# EAGLE design Sonar (EAGLE 7.3.0)
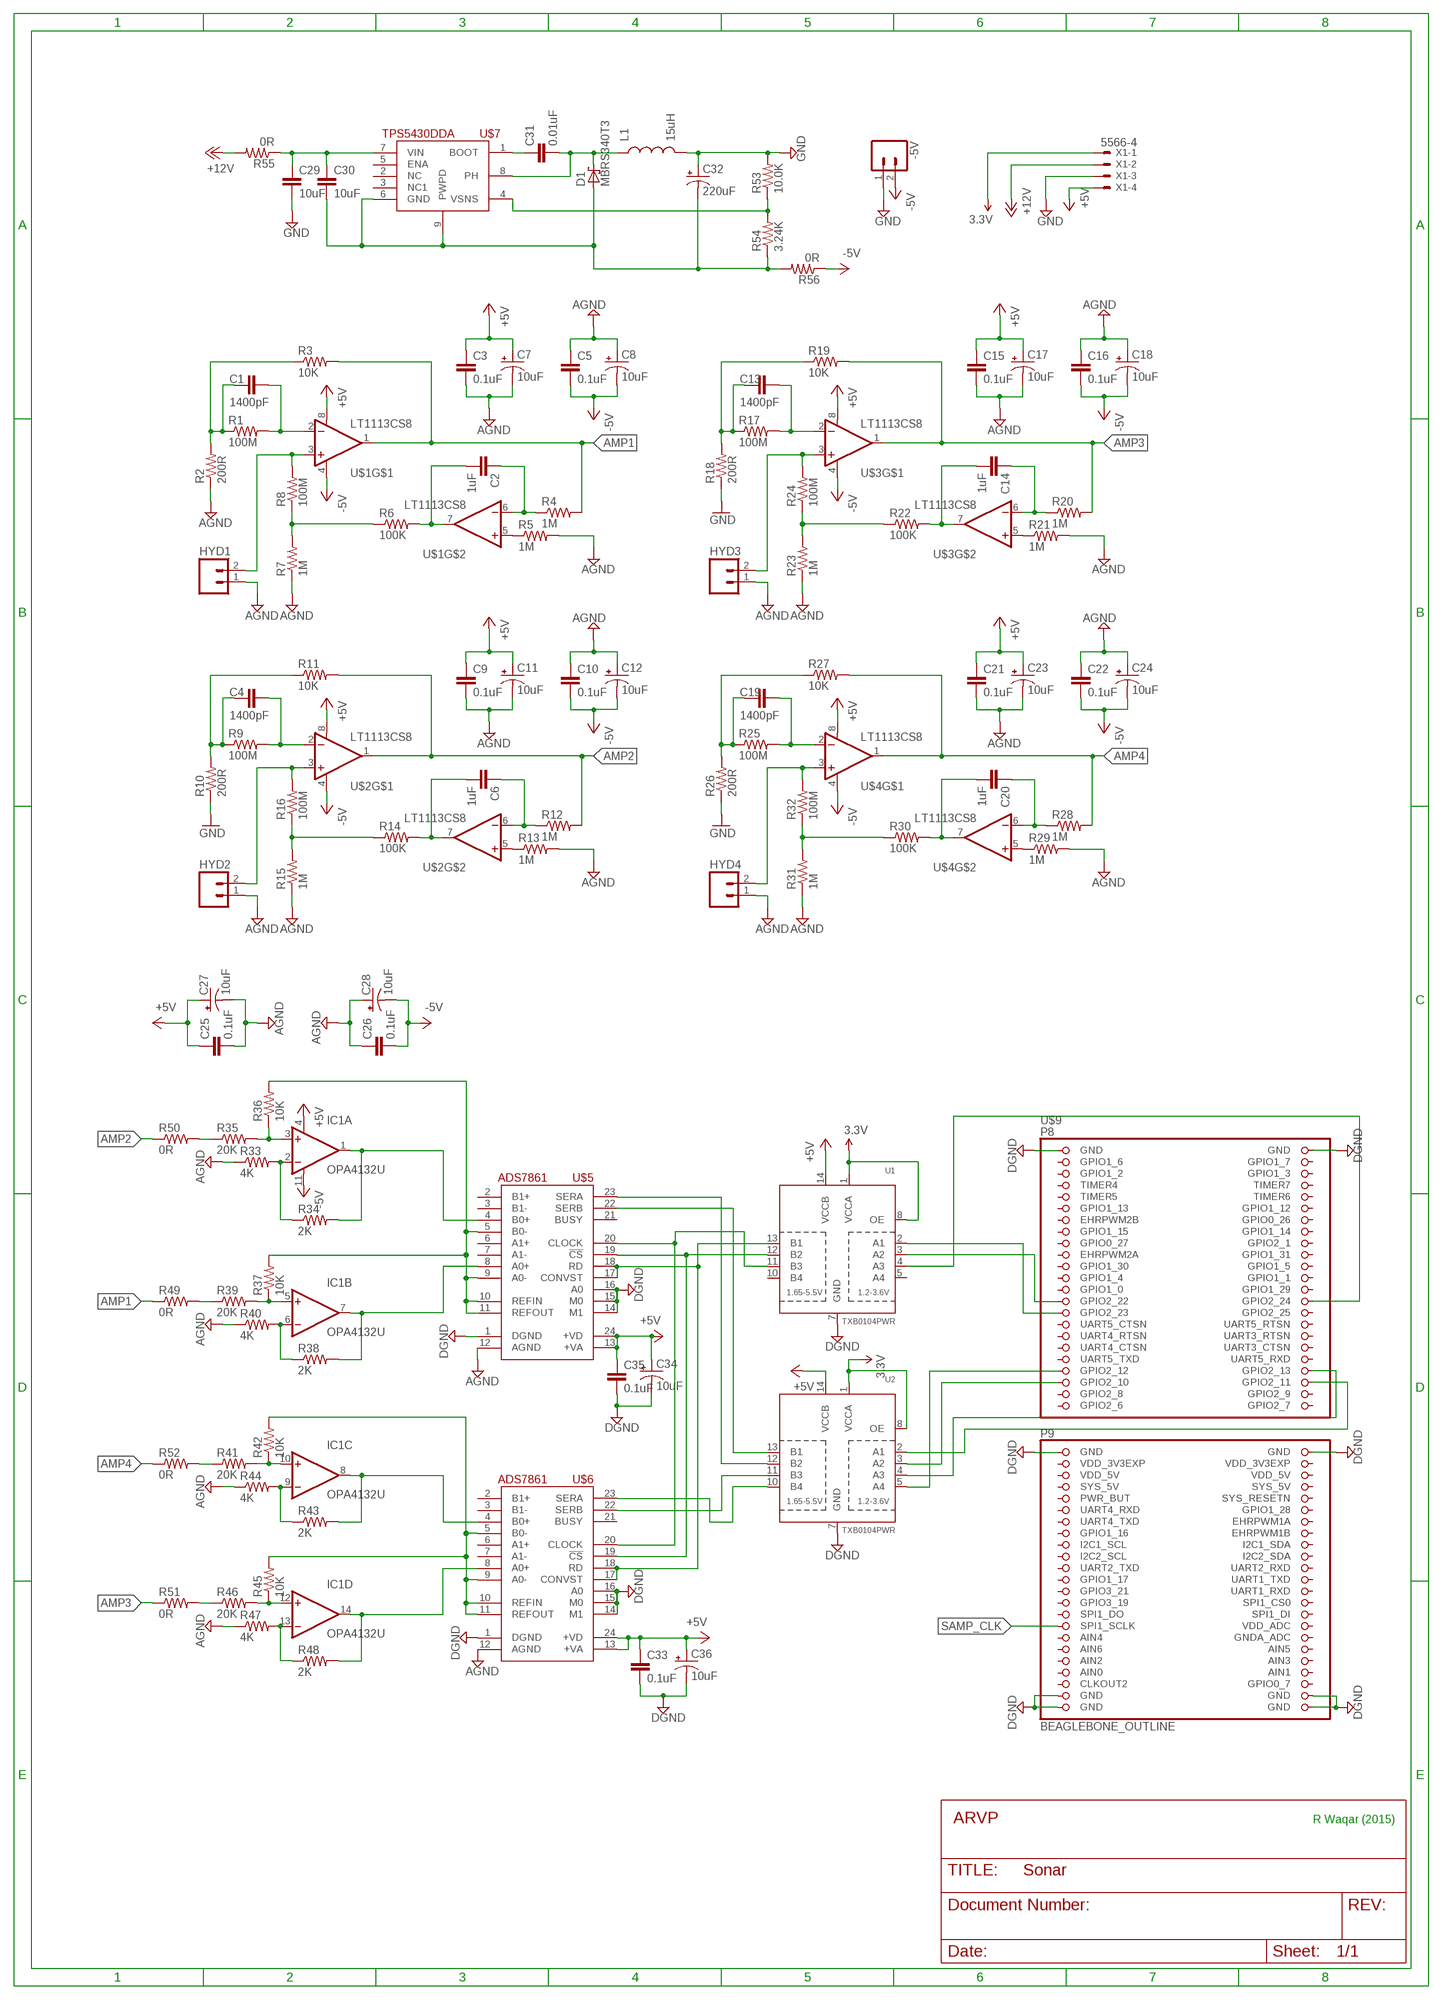
[diagram p0: schematic, sheet 1]

## Parts
-5V  M02PTH3  [1X02_LONGPADS]
C1  1400pF  CAP0805  [0805]
C2  1uF  CAP0805  [0805]
C3  0.1uF  CAP0805  [0805]
C4  1400pF  CAP0805  [0805]
C5  0.1uF  CAP0805  [0805]
C6  1uF  CAP0805  [0805]
C7  10uF  CAP_POL1206  [EIA3216]
C8  10uF  CAP_POL1206  [EIA3216]
C9  0.1uF  CAP0805  [0805]
C10  0.1uF  CAP0805  [0805]
C11  10uF  CAP_POL1206  [EIA3216]
C12  10uF  CAP_POL1206  [EIA3216]
C13  1400pF  CAP0805  [0805]
C14  1uF  CAP0805  [0805]
C15  0.1uF  CAP0805  [0805]
C16  0.1uF  CAP0805  [0805]
C17  10uF  CAP_POL1206  [EIA3216]
C18  10uF  CAP_POL1206  [EIA3216]
C19  1400pF  CAP0805  [0805]
C20  1uF  CAP0805  [0805]
C21  0.1uF  CAP0805  [0805]
C22  0.1uF  CAP0805  [0805]
C23  10uF  CAP_POL1206  [EIA3216]
C24  10uF  CAP_POL1206  [EIA3216]
C25  0.1uF  CAP0805  [0805]
C26  0.1uF  CAP0805  [0805]
C27  10uF  CAP_POL1206  [EIA3216]
C28  10uF  CAP_POL1206  [EIA3216]
C29  10uF  CAP0805  [0805]
C30  10uF  CAP0805  [0805]
C31  0.01uF  CAP0805  [0805]
C32  220uF  CAP_POL7343  [EIA7343]
C33  0.1uF  CAP0805  [0805]
C34  10uF  CAP_POL1206  [EIA3216]
C35  0.1uF  CAP0805  [0805]
C36  10uF  CAP_POL1206  [EIA3216]
D1  MBRS340T3  [SMC]
HYD1  M02POLAR  [MOLEX-1X2]
HYD2  M02POLAR  [MOLEX-1X2]
HYD3  M02POLAR  [MOLEX-1X2]
HYD4  M02POLAR  [MOLEX-1X2]
IC1  OPA4132U  [SO14]
L1  15uH  INDUCTOR1210  [1210]
R1  100M  RESISTOR0805-RES  [0805]
R2  200R  RESISTORAXIAL-0.3  [AXIAL-0.3]
R3  10K  RESISTORAXIAL-0.3  [AXIAL-0.3]
R4  1M  RESISTOR0805-RES  [0805]
R5  1M  RESISTOR0805-RES  [0805]
R6  100K  RESISTOR0805-RES  [0805]
R7  1M  RESISTOR0805-RES  [0805]
R8  100M  RESISTOR0805-RES  [0805]
R9  100M  RESISTOR0805-RES  [0805]
R10  200R  RESISTORAXIAL-0.3  [AXIAL-0.3]
R11  10K  RESISTORAXIAL-0.3  [AXIAL-0.3]
R12  1M  RESISTOR0805-RES  [0805]
R13  1M  RESISTOR0805-RES  [0805]
R14  100K  RESISTOR0805-RES  [0805]
R15  1M  RESISTOR0805-RES  [0805]
R16  100M  RESISTOR0805-RES  [0805]
R17  100M  RESISTOR0805-RES  [0805]
R18  200R  RESISTORAXIAL-0.3  [AXIAL-0.3]
R19  10K  RESISTORAXIAL-0.3  [AXIAL-0.3]
R20  1M  RESISTOR0805-RES  [0805]
R21  1M  RESISTOR0805-RES  [0805]
R22  100K  RESISTOR0805-RES  [0805]
R23  1M  RESISTOR0805-RES  [0805]
R24  100M  RESISTOR0805-RES  [0805]
R25  100M  RESISTOR0805-RES  [0805]
R26  200R  RESISTORAXIAL-0.3  [AXIAL-0.3]
R27  10K  RESISTORAXIAL-0.3  [AXIAL-0.3]
R28  1M  RESISTOR0805-RES  [0805]
R29  1M  RESISTOR0805-RES  [0805]
R30  100K  RESISTOR0805-RES  [0805]
R31  1M  RESISTOR0805-RES  [0805]
R32  100M  RESISTOR0805-RES  [0805]
R33  4K  RESISTOR0805-RES  [0805]
R34  2K  RESISTOR0805-RES  [0805]
R35  20K  RESISTOR0805-RES  [0805]
R36  10K  RESISTOR0805-RES  [0805]
R37  10K  RESISTOR0805-RES  [0805]
R38  2K  RESISTOR0805-RES  [0805]
R39  20K  RESISTOR0805-RES  [0805]
R40  4K  RESISTOR0805-RES  [0805]
R41  20K  RESISTOR0805-RES  [0805]
R42  10K  RESISTOR0805-RES  [0805]
R43  2K  RESISTOR0805-RES  [0805]
R44  4K  RESISTOR0805-RES  [0805]
R45  10K  RESISTOR0805-RES  [0805]
R46  20K  RESISTOR0805-RES  [0805]
R47  4K  RESISTOR0805-RES  [0805]
R48  2K  RESISTOR0805-RES  [0805]
R49  0R  RESISTOR1206  [1206]
R50  0R  RESISTOR1206  [1206]
R51  0R  RESISTOR1206  [1206]
R52  0R  RESISTOR1206  [1206]
R53  10.0K  RESISTOR0805-RES  [0805]
R54  3.24K  RESISTOR0805-RES  [0805]
R55  0R  RESISTOR1206  [1206]
R56  0R  RESISTOR1206  [1206]
U1  TXB0104PWR  [TSSOP14]
U2  TXB0104PWR  [TSSOP14]
U$1  LT1113CS8  [SO-08]
U$2  LT1113CS8  [SO-08]
U$3  LT1113CS8  [SO-08]
U$4  LT1113CS8  [SO-08]
U$5  ADS7861E  [SSOP24]
U$6  ADS7861E  [SSOP24]
U$7  TPS5430DDA  [SOIC8-POWERPAD]
U$8  ARVP_LOGO  [ARVP]
U$9  BEAGLEBONE_OUTLINE  [BEAGLEBONE_SHIELD]
X1  5566-4  [5566-4]

## Nets
3.3V: U1.1(VCCA) U1.8(OE) U2.1(VCCA) U2.8(OE) X1.1
+5V: C3.1 C7.A(+) C9.1 C11.A(+) C15.1 C17.A(+) C21.1 C23.A(+) C25.1 C27.A(+) C33.1 C34.A(+) C35.1 C36.A(+) IC1.4(A:V+) U1.14(VCCB) U2.14(VCCB) U$1.8(V+) U$2.8(V+) U$3.8(V+) U$4.8(V+) U$5.13(+VA) U$5.24(+VD) U$6.13(+VA) U$6.24(+VD) X1.4
+12V: R55.2 X1.2
-5V: -5V.2 C5.2 C8.C(-) C10.2 C12.C(-) C16.2 C18.C(-) C22.2 C24.C(-) C26.2 C28.C(-) IC1.11(A:V-) R56.1 U$1.4(V-) U$2.4(V-) U$3.4(V-) U$4.4(V-)
AMP1: R3.P$2 R4.2 R49.1 U$1.1(OUT)
AMP2: R11.P$2 R12.2 R50.1 U$2.1(OUT)
AMP3: R19.P$2 R20.2 R51.1 U$3.1(OUT)
AMP4: R27.P$2 R28.2 R52.1 U$4.1(OUT)
GND: -5V.1 C3.2 C5.1 C7.C(-) C8.A(+) C9.2 C10.1 C11.C(-) C12.A(+) C15.2 C16.1 C17.C(-) C18.A(+) C21.2 C22.1 C23.C(-) C24.A(+) C25.2 C26.1 C27.C(-) C28.A(+) C29.2 C32.A(+) C33.2 C34.C(-) C35.2 C36.C(-) HYD1.1 HYD2.1 HYD3.1 HYD4.1 L1.2 R2.P$1 R5.2 R7.1 R10.P$1 R13.2 R15.1 R18.P$1 R21.2 R23.1 R26.P$1 R29.2 R31.1 R33.1 R40.1 R44.1 R47.1 R53.2 U1.7(GND) U2.7(GND) U$5.1(DGND) U$5.12(AGND) U$5.14(M1) U$5.15(M0) U$5.16(A0) U$6.1(DGND) U$6.12(AGND) U$6.14(M1) U$6.15(M0) U$6.16(A0) U$9.1(GND) U$9.2(GND) U$9.47(GND) U$9.48(GND) U$9.89(GND) U$9.90(GND) U$9.91(GND) U$9.92(GND) X1.3 ; supply symbol labelled DGND, AGND
N$1: C1.2 R1.1 R2.P$2 R3.P$1
N$2: C1.1 R1.2 U$1.2(-IN)
N$3: C4.2 R9.1 R10.P$2 R11.P$1
N$4: R6.1 R7.2 R8.1
N$5: HYD1.2 R8.2 U$1.3(+IN)
N$6: C4.1 R9.2 U$2.2(-IN)
N$7: C2.2 R6.2 U$1.7(OUT)
N$8: R5.1 U$1.5(+IN)
N$9: C2.1 R4.1 U$1.6(-IN)
N$10: R14.1 R15.2 R16.1
N$11: HYD2.2 R16.2 U$2.3(+IN)
N$12: C6.2 R14.2 U$2.7(OUT)
N$13: R13.1 U$2.5(+IN)
N$14: C6.1 R12.1 U$2.6(-IN)
N$15: C13.2 R17.1 R18.P$2 R19.P$1
N$16: C13.1 R17.2 U$3.2(-IN)
N$17: R22.1 R23.2 R24.1
N$18: HYD3.2 R24.2 U$3.3(+IN)
N$19: C14.2 R22.2 U$3.7(OUT)
N$20: R21.1 U$3.5(+IN)
N$21: C14.1 R20.1 U$3.6(-IN)
N$22: C19.2 R25.1 R26.P$2 R27.P$1
N$23: C19.1 R25.2 U$4.2(-IN)
N$24: R30.1 R31.2 R32.1
N$25: HYD4.2 R32.2 U$4.3(+IN)
N$26: C20.2 R30.2 U$4.7(OUT)
N$27: R29.1 U$4.5(+IN)
N$28: C20.1 R28.1 U$4.6(-IN)
N$29: IC1.3(A:+IN) R35.2 R36.1
N$30: IC1.1(A:OUT) R34.2 U$5.4(B0+)
N$31: IC1.2(A:-IN) R33.2 R34.1
N$32: R36.2 R37.2 U$5.5(B0-) U$5.9(A0-) U$5.10(REFIN) U$5.11(REFOUT)
N$33: IC1.5(B:+IN) R37.1 R39.2
N$34: IC1.6(B:-IN) R38.1 R40.2
N$35: IC1.7(B:OUT) R38.2 U$5.8(A0+)
N$36: IC1.13(D:-IN) R47.2 R48.1
N$37: IC1.14(D:OUT) R48.2 U$6.8(A0+)
N$38: IC1.9(C:-IN) R43.1 R44.2
N$39: IC1.8(C:OUT) R43.2 U$6.4(B0+)
N$40: IC1.10(C:+IN) R41.2 R42.1
N$41: IC1.12(D:+IN) R45.1 R46.2
N$42: R42.2 R45.2 U$6.5(B0-) U$6.9(A0-) U$6.10(REFIN) U$6.11(REFOUT)
N$43: R41.1 R52.2
N$44: R46.1 R51.2
N$45: R35.1 R50.2
N$46: R39.1 R49.2
N$47: U1.4(A3) U$9.28(GPIO2_24)
N$48: U1.13(B1) U$5.17(CONVST) U$5.18(RD) U$6.17(CONVST) U$6.18(RD)
N$49: U1.11(B3) U$5.20(CLOCK) U$6.20(CLOCK)
N$50: U1.12(B2) U$5.19(!CS!) U$6.19(!CS!)
N$52: U2.10(B4) U$6.23(SERA)
N$53: U2.13(B1) U$5.22(SERB)
N$54: U2.11(B3) U$6.22(SERB)
N$55: U2.5(A4) U$9.39(GPIO2_12)
N$56: U2.12(B2) U$5.23(SERA)
N$57: U2.3(A2) U$9.41(GPIO2_10)
N$58: U2.2(A1) U$9.42(GPIO2_11)
N$59: U2.4(A3) U$9.40(GPIO2_13)
N$60: U1.2(A1) U$9.29(GPIO2_23)
N$62: C29.1 C30.1 R55.1 U$7.7(VIN)
N$63: U1.3(A2) U$9.27(GPIO2_22)
N$64: C31.1 U$7.1(BOOT)
N$65: C31.2 D1.C L1.1 U$7.8(PH)
N$67: R53.1 R54.2 U$7.4(VSNS)
N$69: C30.2 C32.C(-) D1.A R54.1 R56.2 U$7.6(GND) U$7.9(PWPD)
SAMP_CLK: U$9.77(SPI1_SCLK)
Unconnected: U1.5(A4) U1.10(B4) U$5.2(B1+) U$5.3(B1-) U$5.6(A1+) U$5.7(A1-) U$5.21(BUSY) U$6.2(B1+) U$6.3(B1-) U$6.6(A1+) U$6.7(A1-) U$6.21(BUSY) U$7.2(NC) U$7.3(NC1) U$7.5(ENA) U$9.3(GPIO1_6) U$9.4(GPIO1_7) U$9.5(GPIO1_2) U$9.6(GPIO1_3) U$9.7(TIMER4) U$9.8(TIMER7) U$9.9(TIMER5) U$9.10(TIMER6) U$9.11(GPIO1_13) U$9.12(GPIO1_12) U$9.13(EHRPWM2B) U$9.14(GPIO0_26) U$9.15(GPIO1_15) U$9.16(GPIO1_14) U$9.17(GPIO0_27) U$9.18(GPIO2_1) U$9.19(EHRPWM2A) U$9.20(GPIO1_31) U$9.21(GPIO1_30) U$9.22(GPIO1_5) U$9.23(GPIO1_4) U$9.24(GPIO1_1) U$9.25(GPIO1_0) U$9.26(GPIO1_29) U$9.30(GPIO2_25) U$9.31(UART5_CTSN) U$9.32(UART5_RTSN) U$9.33(UART4_RTSN) U$9.34(UART3_RTSN) U$9.35(UART4_CTSN) U$9.36(UART3_CTSN) U$9.37(UART5_TXD) U$9.38(UART5_RXD) U$9.43(GPIO2_8) U$9.44(GPIO2_9) U$9.45(GPIO2_6) U$9.46(GPIO2_7) U$9.54(SYS_5V) U$9.55(PWR_BUT) U$9.56(SYS_RESETN) U$9.57(UART4_RXD) U$9.58(GPIO1_28) U$9.59(UART4_TXD) U$9.60(EHRPWM1A) U$9.61(GPIO1_16) U$9.62(EHRPWM1B) U$9.63(I2C1_SCL) U$9.64(I2C1_SDA) U$9.65(I2C2_SCL) U$9.66(I2C2_SDA) U$9.67(UART2_TXD) U$9.68(UART2_RXD) U$9.69(GPIO1_17) U$9.70(UART1_TXD) U$9.71(GPIO3_21) U$9.72(UART1_RXD) U$9.73(GPIO3_19) U$9.74(SPI1_CS0) U$9.75(SPI1_DO) U$9.76(SPI1_DI) U$9.78(VDD_ADC) U$9.79(AIN4) U$9.80(GNDA_ADC) U$9.81(AIN6) U$9.82(AIN5) U$9.83(AIN2) U$9.84(AIN3) U$9.86(AIN1) U$9.87(CLKOUT2) U$9.88(GPIO0_7)

## Notes on the sheet
- R Waqar (2015)

## Power pins joined to a net without a drawn wire
AIN0: U$9.85(AIN0)
SYS_5V: U$9.53(SYS_5V)
VDD_3V3EXP: U$9.49(VDD_3V3EXP) U$9.50(VDD_3V3EXP)
VDD_5V: U$9.51(VDD_5V) U$9.52(VDD_5V)

## Library data of the parts
-5V HYD1-HYD4 = SparkFun:M02: Header 2 Standard 2-pin 0.1" header. Use with straight break away headers (SKU : PRT-00116), right angle break away headers (PRT-00553), swiss pins (PRT-00743), machine pins (PRT-00117), and female headers (PRT-00115). Molex polarized connector foot print use with SKU : PRT-08233 with associated crimp pins and housings.
C1-C6 C9 C10 C13-C16 C19-C22 C25 C26 C29-C31 C33 C35 = SparkFun:CAP: Capacitor Standard 0603 ceramic capacitor, and 0.1" leaded capacitor.
C7 C8 C11 C12 C17 C18 C23 C24 C27 C28 C32 C34 C36 = SparkFun:CAP_POL: Capacitor Polarized These are standard SMD and PTH capacitors. Normally 10uF, 47uF, and 100uF in electrolytic and tantalum varieties. Always verify the external diameter of the through hole cap, it varies with capacity, voltage, and manufacturer. The EIA devices should be standard.
D1 = diode:MBRS3*0T3: SCHOTTKY BARRIER RECTIFIER 3.0 AMPERES 20, 30, 40 VOLT Source: MBRS340T3-D.pdf
IC1 = burr-brown:OPA4132: High Speed FET-Input Operational Amplifiers; MF: TEXAS INSTRUMENTS; MPN: OPA4132UA; OC_FARNELL: 1212302; OC_NEWARK: 80K6028
L1 = SparkFun:INDUCTOR: Inductors Basic Inductor/Choke - 0603 and 1206. Footprints are not proven and vary greatly between part numbers.
R1-R56 = SparkFun:RESISTOR: Resistor Basic schematic elements and footprints for 0603, 1206, and PTH resistors.
U1 U2 = adafruit:TXB0104PWR: 4-Bit Bi-Directional Level Shifter 1.2V-3.6V (VCCA) to 1.65V-5.5V (VCCB) bi-directional level shifter with auto direction sensing. Max data rate - VCCA 1.8V: 20Mbps (50ns), VCCA 3.3V: 100Mbps (10ns) Digikey: 296-21929-1-ND
U$1-U$4 = ARVP:LT1113: LT1113 Dual Low Noise, Precision, JFET Input Op Amps
U$5 U$6 = ARVP:ADS7861: ADS7861 Dual, 500kHz, 12-Bit, 2+2 Ch, Simultaneous Sampling Analog-To-Digital Converter
U$7 = ARVP:TPS5430: TPS5430 5.5V to 36V Input, 3A, 500kHz Step-Down Converter
U$8 = ARVP:ARVP_LOGO
U$9 = adafruit:BEAGLEBONE_OUTLINE: Should match A3 pinout - but not completely tested
X1 = con-molex:5566-4: Mini FIT connector 4 pol Source: http://www.molex.com; OC_FARNELL: unknown; OC_NEWARK: unknown

## Board
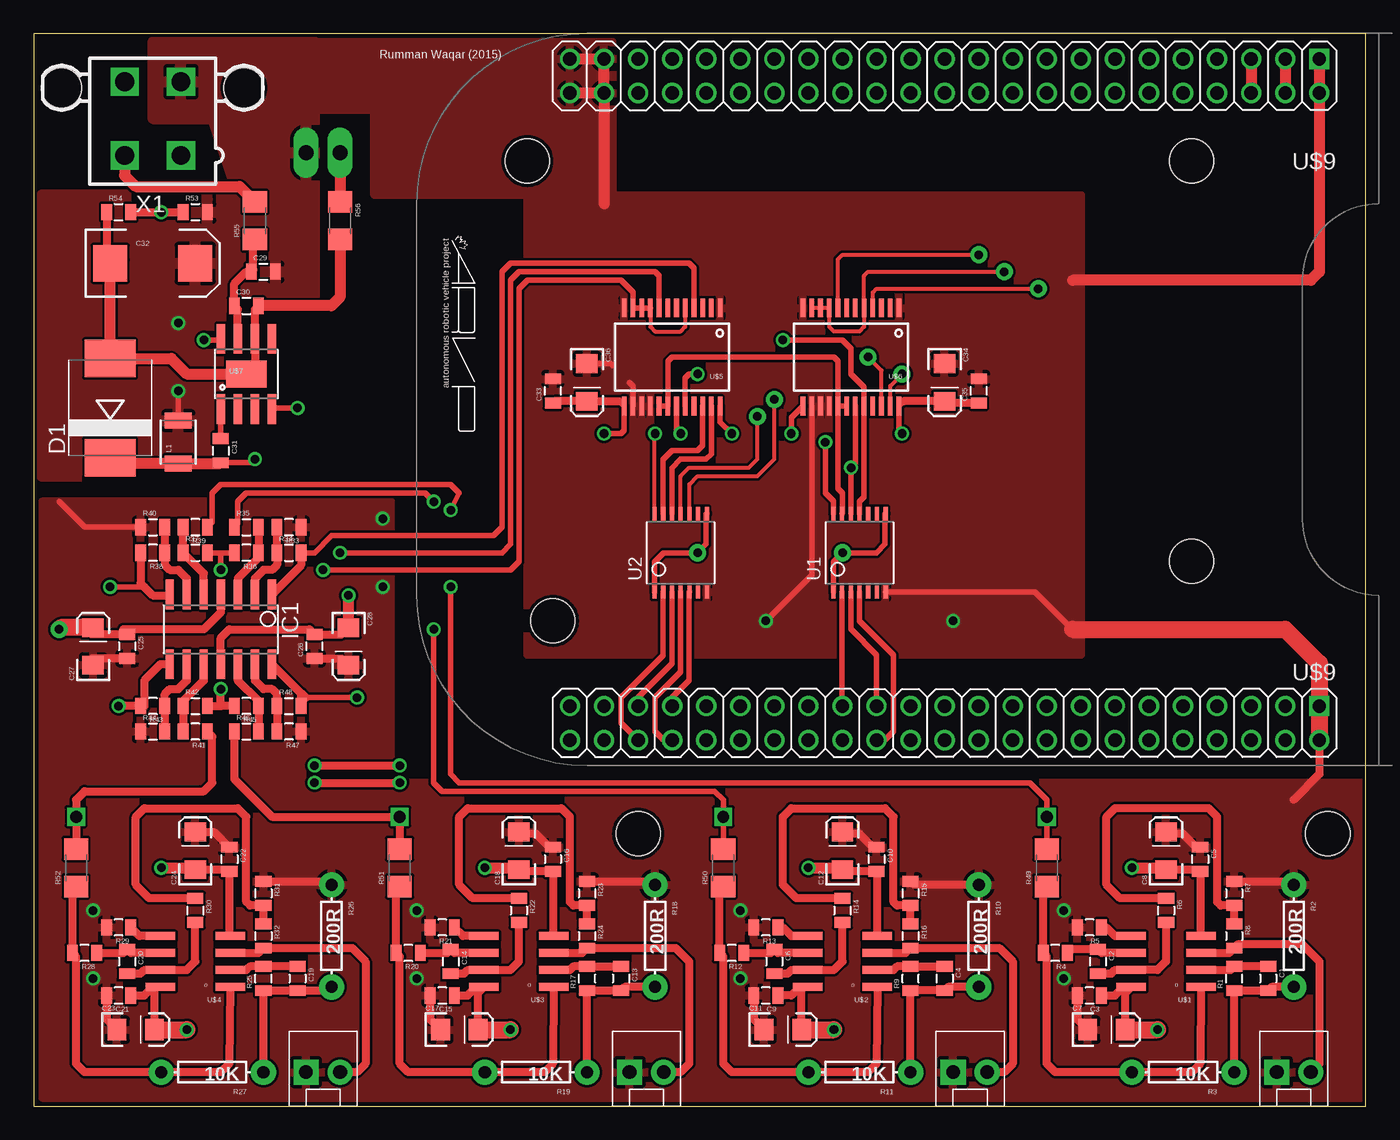
[diagram p1: board, top side]
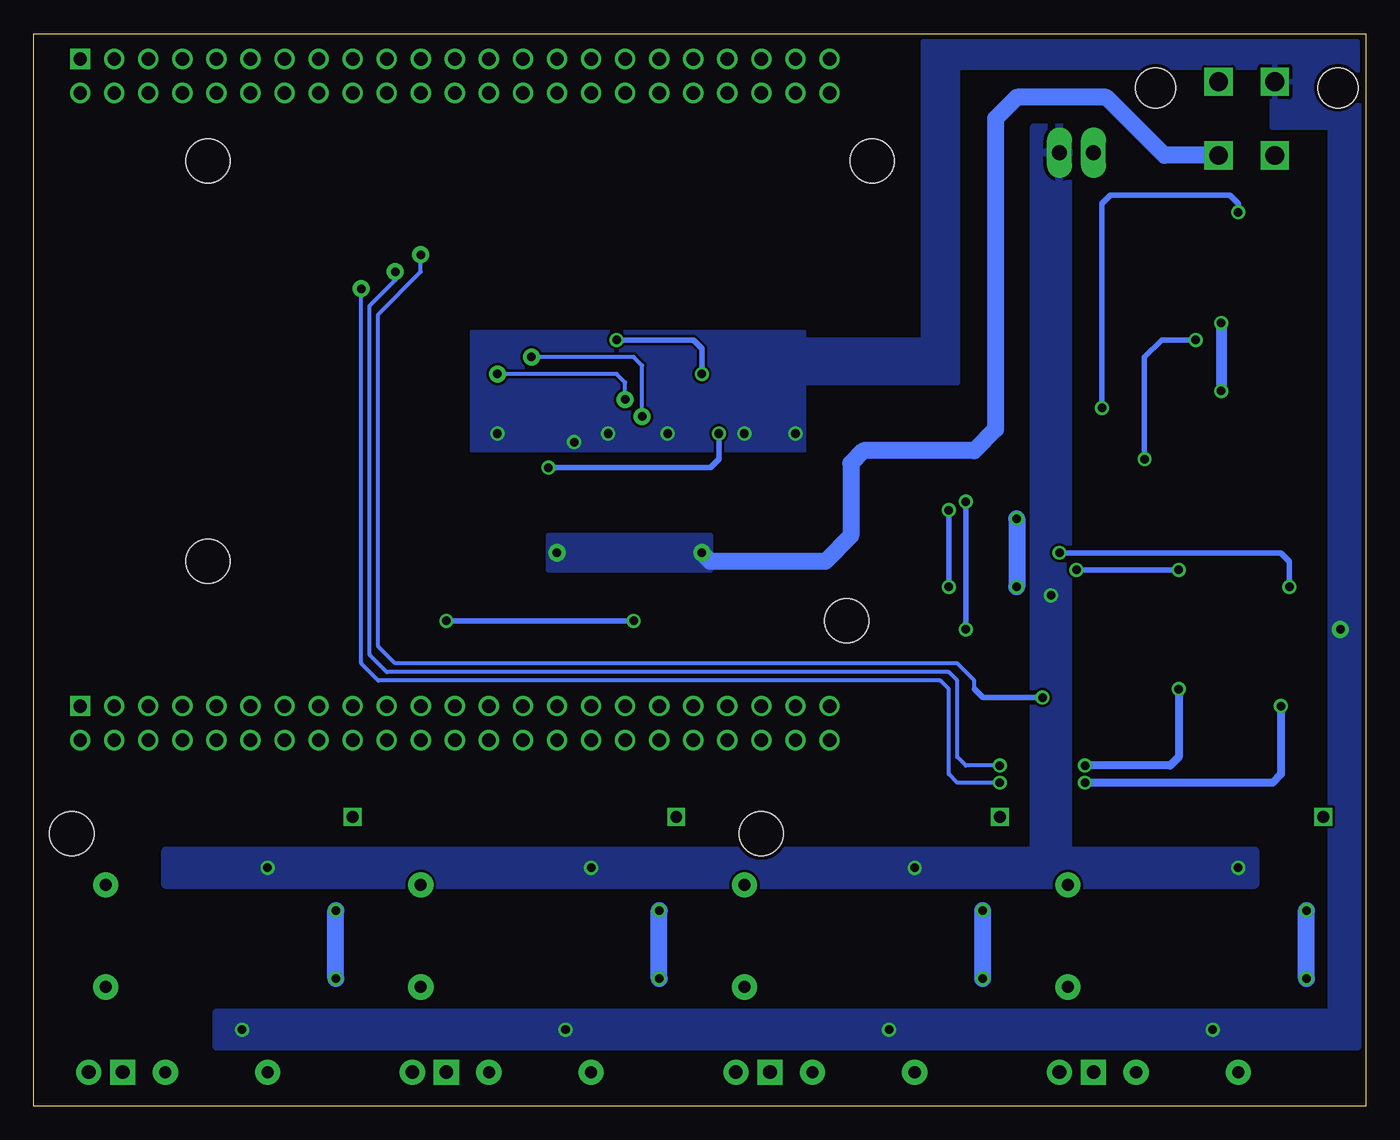
[diagram p2: board, bottom side, seen from below]

Size 99.36 x 80 mm. Coordinates in mm from the lower left corner, seen from the top.
Outline: 0,0 99.36,0 99.36,80 0,80 0,0
Copper layers (1*16): Top 0.035mm / dielectric 1.5mm / Bottom 0.035mm
Design rules "apcircuits": minimum track width 0.18mm, minimum drill 20mil, track to track 0.18mm, track to pad 0.18mm, pad to pad 0.18mm, via to via 0.18mm, smd to smd 0.18mm, copper to edge 0.25mm, drill to drill 0.25mm, minimum pad ring 10mil, minimum via ring 8mil, stop-mask expansion 4mil, vias tented up to drill 0mil, thermal gap 10mil

### Footprints (pad centres in the part's own frame; a part is rotated, then mirrored left to right if it is on the bottom)
1X02_LONGPADS = drill 1.118 pad 1.88 long: 1 0,0; 2 2.54,0
0805 = smd 0.8 x 1.2: 1 -0.9,0; 2 0.9,0
EIA3216 = smd 1.4 x 1.6: A 1.4,0; C -1.4,0
EIA7343 = smd 2.55 x 2.7: A 3.17,0; C -3.17,0
SMC = smd 2.8 x 3.8: A 3.7,0; C -3.7,0
MOLEX-1X2 = drill 1.016 pad 1.88 square: 1 0,0 | drill 1.016 pad 1.88: 2 2.54,0
SO14 = smd 0.61 x 2.21: 1 -3.81,-2.603; 2 -2.54,-2.603; 3 -1.27,-2.603; 4 0,-2.603; 5 1.27,-2.603; 6 2.54,-2.603; 7 3.81,-2.603; 8 3.81,2.603; 9 2.54,2.603; 10 1.27,2.603; 11 0,2.603; 12 -1.27,2.603; 13 -2.54,2.603; 14 -3.81,2.603
1210 = smd 1.2 x 2: 1 -1.6,0; 2 1.6,0
AXIAL-0.3 = drill 0.9 pad 1.88: P$1 -3.81,0; P$2 3.81,0
1206 = smd 1.6 x 1.8: 1 -1.4,0; 2 1.4,0
TSSOP14 = smd 0.305 x 0.991: 1 -1.95,-2.918; 2 -1.3,-2.918; 3 -0.65,-2.918; 4 0,-2.918; 5 0.65,-2.918; 6 1.3,-2.918; 7 1.95,-2.918; 8 1.95,2.918; 9 1.3,2.918; 10 0.65,2.918; 11 0,2.918; 12 -0.65,2.918; 13 -1.3,2.918; 14 -1.95,2.918
SO-08 = smd 0.6 x 2.2: 1 -1.905,-2.6; 2 -0.635,-2.6; 3 0.635,-2.6; 4 1.905,-2.6; 5 1.905,2.6; 6 0.635,2.6; 7 -0.635,2.6; 8 -1.905,2.6
SSOP24 = smd 0.348 x 1.397: 1 -3.575,-3.656; 2 -2.925,-3.656; 3 -2.275,-3.656; 4 -1.625,-3.656; 5 -0.975,-3.656; 6 -0.325,-3.656; 7 0.325,-3.656; 8 0.975,-3.656; 9 1.625,-3.656; 10 2.275,-3.656; 11 2.925,-3.656; 12 3.575,-3.656; 13 3.575,3.656; 14 2.925,3.656; 15 2.275,3.656; 16 1.625,3.656; 17 0.975,3.656; 18 0.325,3.656; 19 -0.325,3.656; 20 -0.975,3.656; 21 -1.625,3.656; 22 -2.275,3.656; 23 -2.925,3.656; 24 -3.575,3.656
SOIC8-POWERPAD = smd 0.61 x 2.21: 1 -1.905,-2.616; 2 -0.635,-2.616; 3 0.635,-2.616; 4 1.905,-2.616; 5 1.905,2.616; 6 0.635,2.616; 7 -0.635,2.616; 8 -1.905,2.616 | smd 2.997 x 2: 9 0,0
BEAGLEBONE_SHIELD = drill 1 square: 1 4.445,19.05; 47 52.705,19.05 | drill 1: 2 1.905,19.05; 3 4.445,21.59; 4 1.905,21.59; 5 4.445,24.13; 6 1.905,24.13; 7 4.445,26.67; 8 1.905,26.67; 9 4.445,29.21; 10 1.905,29.21; 11 4.445,31.75; 12 1.905,31.75; 13 4.445,34.29; 14 1.905,34.29; 15 4.445,36.83; 16 1.905,36.83; 17 4.445,39.37; 18 1.905,39.37; 19 4.445,41.91; 20 1.905,41.91; 21 4.445,44.45; 22 1.905,44.45; 23 4.445,46.99; 24 1.905,46.99; 25 4.445,49.53; 26 1.905,49.53; 27 4.445,52.07; 28 1.905,52.07; 29 4.445,54.61; 30 1.905,54.61; 31 4.445,57.15; 32 1.905,57.15; 33 4.445,59.69; 34 1.905,59.69; 35 4.445,62.23; 36 1.905,62.23; 37 4.445,64.77; 38 1.905,64.77; 39 4.445,67.31; 40 1.905,67.31; 41 4.445,69.85; 42 1.905,69.85; 43 4.445,72.39; 44 1.905,72.39; 45 4.445,74.93; 46 1.905,74.93; 48 50.165,19.05; 49 52.705,21.59; 50 50.165,21.59; 51 52.705,24.13; 52 50.165,24.13; 53 52.705,26.67; 54 50.165,26.67; 55 52.705,29.21; 56 50.165,29.21; 57 52.705,31.75; 58 50.165,31.75; 59 52.705,34.29; 60 50.165,34.29; 61 52.705,36.83; 62 50.165,36.83; 63 52.705,39.37; 64 50.165,39.37; 65 52.705,41.91; 66 50.165,41.91; 67 52.705,44.45; 68 50.165,44.45; 69 52.705,46.99; 70 50.165,46.99; 71 52.705,49.53; 72 50.165,49.53; 73 52.705,52.07; 74 50.165,52.07; 75 52.705,54.61; 76 50.165,54.61; 77 52.705,57.15; 78 50.165,57.15; 79 52.705,59.69; 80 50.165,59.69; 81 52.705,62.23; 82 50.165,62.23; 83 52.705,64.77; 84 50.165,64.77; 85 52.705,67.31; 86 50.165,67.31; 87 52.705,69.85; 88 50.165,69.85; 89 52.705,72.39; 90 50.165,72.39; 91 52.705,74.93; 92 50.165,74.93
STAND-OFF = hole 3.302: 0,0
5566-4 = drill 1.4 square: 1 2.1,-2.75; 2 -2.1,-2.75; 3 2.1,2.75; 4 -2.1,2.75 | hole 3: 6.8,2.29; -6.8,2.29

### Placement (x,y rotation side)
-5V  20.32,71.12 0 top
C1  92.08,9.53 270 top
C2  79.38,10.79 270 top
C3  78.74,8.26 180 top
C4  67.94,9.53 270 top
C5  87,18.41 270 top
C6  55.24,10.79 270 top
C7  80.01,5.71 0 top
C8  84.45,19.05 90 top
C9  54.61,8.26 180 top
C10  62.87,18.41 270 top
C11  55.88,5.71 0 top
C12  60.33,19.05 90 top
C13  43.81,9.53 270 top
C14  31.11,10.79 270 top
C15  30.48,8.26 180 top
C16  38.73,18.41 270 top
C17  31.75,5.71 0 top
C18  36.2,19.05 90 top
C19  19.68,9.53 270 top
C20  6.99,10.79 270 top
C21  6.35,8.26 180 top
C22  14.61,18.41 270 top
C23  7.62,5.71 0 top
C24  12.06,19.05 90 top
C25  6.99,34.29 270 top
C26  20.95,34.29 90 top
C27  4.45,34.29 90 top
C28  23.5,34.29 270 top
C29  17.14,62.23 0 top
C30  15.88,59.69 0 top
C31  13.97,48.9 270 top
C32  8.89,62.87 0 top
C33  38.73,53.34 90 top
C34  67.94,53.98 270 top
C35  70.48,53.34 90 top
C36  41.27,53.98 270 top
D1  5.71,52.07 90 top
HYD1  92.71,2.54 0 top
HYD2  68.58,2.54 0 top
HYD3  44.45,2.54 0 top
HYD4  20.32,2.54 0 top
IC1  13.97,35.56 180 top
L1  10.79,49.53 90 top
R1  89.53,9.53 90 top
R2  93.98,12.7 270 top
R3  85.72,2.54 180 top
R4  76.2,11.43 180 top
R5  78.74,13.34 180 top
R6  84.45,14.61 270 top
R7  89.53,15.88 270 top
R8  89.53,12.7 270 top
R9  65.41,9.53 90 top
R10  70.48,12.7 270 top
R11  61.59,2.54 180 top
R12  52.07,11.43 180 top
R13  54.61,13.34 180 top
R14  60.33,14.61 270 top
R15  65.41,15.88 270 top
R16  65.41,12.7 270 top
R17  41.27,9.53 90 top
R18  46.35,12.7 270 top
R19  37.47,2.54 180 top
R20  27.94,11.43 180 top
R21  30.48,13.34 180 top
R22  36.2,14.61 270 top
R23  41.27,15.88 270 top
R24  41.27,12.7 270 top
R25  17.14,9.53 90 top
R26  22.23,12.7 270 top
R27  13.34,2.54 180 top
R28  3.81,11.43 180 top
R29  6.35,13.34 180 top
R30  12.06,14.61 270 top
R31  17.14,15.88 270 top
R32  17.14,12.7 270 top
R33  19.05,43.18 180 top
R34  19.05,41.27 0 top
R35  15.88,43.18 0 top
R36  15.88,41.27 180 top
R37  12.06,41.27 0 top
R38  8.89,41.27 180 top
R39  12.06,43.18 180 top
R40  8.89,43.18 0 top
R41  12.06,27.94 180 top
R42  12.06,29.84 0 top
R43  8.89,29.84 180 top
R44  8.89,27.94 0 top
R45  15.88,29.84 180 top
R46  15.88,27.94 0 top
R47  19.05,27.94 180 top
R48  19.05,29.84 0 top
R49  75.56,17.78 90 top
R50  51.44,17.78 90 top
R51  27.3,17.78 90 top
R52  3.17,17.78 90 top
R53  12.06,66.67 0 top
R54  6.35,66.67 0 top
R55  16.51,66.04 90 top
R56  22.86,66.04 270 top
U1  61.59,41.27 0 top
U2  48.26,41.27 0 top
U$1  84.45,10.79 90 top
U$2  60.33,10.79 90 top
U$3  36.2,10.79 90 top
U$4  12.06,10.79 90 top
U$5  47.62,55.88 180 top
U$6  60.96,55.88 180 top
U$7  15.88,54.61 0 top
U$8  30.48,64.77 270 top
U$9  114.94,25.4 90 top
U$10  [STAND-OFF]  86.36,70.48 0 top
U$11  [STAND-OFF]  86.36,40.64 0 top
U$12  [STAND-OFF]  36.83,70.48 0 top
U$13  [STAND-OFF]  38.73,36.2 0 top
U$14  [STAND-OFF]  96.52,20.32 0 top
U$15  [STAND-OFF]  45.09,20.32 0 top
X1  8.89,73.66 0 top

### Tracks (layer width: path | path; a pad name or v marks a point on that pad's centre or on a via)
3.3V  (via drill 0.64 pad 1.27)
  Top 0.406: U1.1 59.65,40.59 v60.33,41.27 62.87,41.27 63.5,41.91 63.5,44.15 U1.8 | U2.1 46.31,40.59 46.99,41.27 v49.53,41.27 50.16,41.91 50.16,44.15 U2.8
  Bottom 1.27: X1.1 15.03,70.91 19.37,75.25 26.04,75.25 27.62,73.66 27.62,50.48 29.21,48.9 37.47,48.9 38.42,47.94 38.42,42.55 40.32,40.64 48.9,40.64 v49.53,41.27
  pour Bottom: 48.9,42.55 60.96,42.55 60.96,40.01 48.9,40.01
+5V  (via drill 0.64 pad 0.61, 0.64 pad 0.81, 0.64 pad 1.27)
  Top 0.305: U2.14 46.31,50.12 v46.35,50.16
  Top 0.406: 43.7,52.58 U$5.13 44.05,50.4 43.81,50.16 v42.55,50.16 | 64.89,52.58 U$6.24 64.53,50.4 v64.77,50.16 | U$5.24 51.2,51.03 v52.07,50.16 | U1.14 59.65,45.13 59.05,45.72 v59.05,49.53 | v56.52,50.16 56.52,51.35 U$6.13
  Top 0.61: C7.A 81.41,8.45 U$1.8 81.28,8.89 80.64,8.26 C3.1 | U$2.8 57.15,8.89 | 57.15,8.89 56.52,8.26 C9.1 | C11.A 57.28,8.76 57.15,8.89 | C17.A 33.15,8.45 U$3.8 33.02,8.89 32.38,8.26 C15.1 | C23.A 9.02,8.76 8.89,8.89 | C21.1 8.26,8.26 8.89,8.89 | C27.A 4.31,35.19 C25.1 6.72,35.56 12.7,35.56 13.97,36.83 IC1.4 | U$4.8 8.89,8.89 | C33.1 38.87,52.58 C36.A 43.7,52.58 | C35.1 68.08,52.44 C34.A 64.89,52.58
  Top 1.27: C23.A v11.43,5.71 | C17.A v35.56,5.71 | C11.A v59.69,5.71 | C7.A v83.82,5.71 | C27.A 2.04,35.69 v1.91,35.56
  pour Bottom: 0.64,79.38 0.64,4.45 85.72,4.45 85.72,6.99 2.54,6.99 2.54,79.38
  pour Bottom: 41.91,57.78 41.91,48.9 66.67,48.9 66.67,57.78
  pour Bottom: 0.64,73.03 0.64,79.38 33.02,79.38 33.02,57.15 43.81,57.15 43.81,53.98 30.48,53.98 30.48,77.47 6.99,77.47 6.99,73.03
+12V
  Top 0.813: X1.2 6.79,69.41 7.62,68.58 15.37,68.58 R55.2
-5V  (via drill 0.64 pad 0.61, 0.64 pad 0.81)
  Top 0.61: U$1.4 87.06,17.45 C5.2 86.86,17.65 C8.C | U$2.4 62.92,17.45 C10.2 60.46,17.52 C12.C | U$3.4 38.8,17.45 C16.2 36.33,17.52 C18.C | U$4.4 14.61,12.76 C22.2 14.47,17.65 C24.C | C28.C 23,35.19 C26.2 20.59,35.56 14.61,35.56 13.97,34.92 IC1.11
  Top 0.813: v81.92,17.78 83.82,17.78 C8.C | v57.78,17.78 59.69,17.78 C12.C | v33.66,17.78 35.56,17.78 C18.C | v9.53,17.78 11.43,17.78 C24.C | -5V.2 R56.1 | C28.C v23.5,38.1
  pour Bottom: 8.26,19.05 89.53,19.05 89.53,16.51 8.26,16.51
  pour Bottom: 24.77,73.03 22.23,73.03 22.23,19.05 8.26,19.05 8.26,16.51 89.53,16.51 89.53,19.05 24.77,19.05
AMP1
  Top 0.61: R49.1 75.3,16.11 R4.2 75.56,11.16 75.56,3.17 76.2,2.54 R3.P$2 86.36,2.54 87,3.17 U$1.1
AMP2
  Top 0.61: R50.1 51.17,16.11 R12.2 51.44,11.16 51.44,3.17 52.07,2.54 R11.P$2 62.23,2.54 62.87,3.17 U$2.1
AMP3
  Top 0.61: R51.1 27.04,16.11 R20.2 27.3,11.16 27.3,3.17 27.94,2.54 R19.P$2 38.1,2.54 38.73,3.17 U$3.1
AMP4
  Top 0.61: R52.1 2.91,16.11 R28.2 3.17,11.16 3.17,3.17 3.81,2.54 R27.P$2 13.97,2.54 14.61,3.17 U$4.1
GND  (via drill 0.64 pad 0.61, 0.64 pad 0.81)
  Top 0.406: U1.7 74.67,38.36 77.47,35.56 | C36.C 43.05,55.38 43.18,55.24 | U$5.14 44.7,53.73 44.45,53.98 | 6.35,43.18 R40.1 3.81,43.18 1.91,45.09 | L1.2 10.79,52.7 | U$6.14 58.03,39.62 v54.61,36.2
  Top 0.61: R7.1 93.72,16.77 R2.P$1 | C5.1 86.73,19.32 85.72,20.32 84.58,20.32 C8.A | C3.2 77.84,6.49 C7.C | C9.2 53.71,6.49 C11.C | R10.P$1 65.67,16.51 R15.1 | C10.1 62.6,19.32 61.59,20.32 60.45,20.32 C12.A | R23.1 46.09,16.77 R18.P$1 | C15.2 29.58,6.49 C17.C | C16.1 38.47,19.32 37.47,20.32 36.33,20.32 C18.A | R31.1 21.96,16.77 R26.P$1 | C24.A 13.47,20.45 C22.1 | C21.2 5.45,6.49 C23.C | C25.2 4.31,33.39 C27.C | C26.1 23,33.39 C28.A | U$9.2 95.89,24.77 93.98,22.86
  Top 0.813: U$9.91 U$9.89 U$9.90 | U$9.90 U$9.92 | U$9.90 42.55,67.31 | U$9.47 U$9.48 95.89,62.23 95.25,61.59 77.47,61.59
  Top 1.27: U$9.2 U$9.1 95.89,33.02 93.34,35.56 77.47,35.56
  Bottom 0.406: v54.61,36.2 v68.58,36.2
  Bottom 0.813: v10.79,58.42 v10.79,53.34
  Bottom 1.27: v4.45,9.53 v4.45,14.61 | v28.57,9.53 v28.57,14.61 | v52.7,9.53 v52.7,14.61 | v76.83,9.53 v76.83,14.61 | v26.04,43.81 v26.04,38.73
  pour Top (rank 2): 1.27,45.09 0.64,45.09 0.64,0.64 99.06,0.64 99.06,24.13 26.67,24.13 26.67,45.09
  pour Top: 36.83,67.94 78.11,67.94 78.11,33.66 36.83,33.66
  pour Top: 0.64,46.99 20.95,46.99 20.95,79.38 8.89,79.38 8.89,73.66 13.34,73.66 15.24,67.94 0.64,67.94
  pour Top: 20.32,79.38 43.18,79.38 43.18,67.94 25.4,67.94 25.4,74.3 20.32,74.3
N$1
  Top 0.61: R2.P$2 92.34,8.89 C1.2 R1.1 R3.P$1
N$2
  Top 0.61: C1.1 R1.2 89.27,10.16 U$1.2
N$3
  Top 0.61: R10.P$2 68.21,8.89 C4.2 R9.1 R11.P$1
N$4
  Top 0.61: R8.1 R7.2 88.53,14.97 88.27,15.24 88.27,21.59 87.63,22.23 80.64,22.23 80.01,21.59 80.01,16.51 81.02,15.51 R6.1
N$5
  Top 0.61: U$1.3 89.17,11.43 R8.2 89.8,12.06 94.61,12.06 95.89,10.79 95.89,3.17 HYD1.2
N$6
  Top 0.61: U$2.2 64.14,10.16 64.4,10.43 R9.2 C4.1
N$7
  Top 0.61: C2.2 80.38,9.89 80.64,10.16 U$1.7 83.82,10.16 84.45,10.79 R6.2
N$8
  Top 0.61: R5.1 80.01,13.34 80.64,12.7 U$1.5
N$9
  Top 0.61: U$1.6 79.64,11.43 C2.1 77.36,11.7 R4.1
N$10
  Top 0.61: R16.1 R15.2 64.4,14.97 64.14,15.24 64.14,21.59 63.5,22.23 56.52,22.23 55.88,21.59 55.88,16.51 56.88,15.51 R14.1
N$11
  Top 0.61: U$2.3 65.03,11.43 R16.2 72.02,11.8 73.03,10.79 73.03,3.17 72.39,2.54 HYD2.2
N$12
  Top 0.61: C6.2 56.25,9.89 56.52,10.16 U$2.7 59.69,10.16 60.33,10.79 R14.2
N$13
  Top 0.61: U$2.5 56.52,12.7 55.88,13.34 R13.1
N$14
  Top 0.61: U$2.6 55.51,11.43 C6.1 54.98,11.43 R12.1
N$15
  Top 0.61: R19.P$1 R17.1 C13.2 44.08,8.89 R18.P$2
N$16
  Top 0.61: U$3.2 40.01,10.16 40.27,10.43 R17.2 C13.1
N$17
  Top 0.61: R24.1 R23.2 40.27,14.97 40.01,15.24 40.01,21.59 39.37,22.23 32.38,22.23 31.75,21.59 31.75,16.51 32.76,15.51 R22.1
N$18
  Top 0.61: U$3.3 40.91,11.43 R24.2 47.89,11.8 48.9,10.79 48.9,3.17 48.26,2.54 HYD3.2
N$19
  Top 0.61: C14.2 32.12,9.89 32.38,10.16 U$3.7 35.56,10.16 36.2,10.79 R22.2
N$20
  Top 0.61: U$3.5 32.02,12.7 R21.1
N$21
  Top 0.61: U$3.6 31.38,11.43 C14.1 30.85,11.43 R20.1
N$22
  Top 0.61: R27.P$1 R25.1 C19.2 21.96,8.62 R26.P$2
N$23
  Top 0.61: C19.1 R25.2 16.14,10.43 15.88,10.16 U$4.2
N$24
  Top 0.61: R32.1 R31.2 16.14,14.97 15.88,15.24 15.88,21.59 15.24,22.23 8.26,22.23 7.62,21.59 7.62,16.51 8.62,15.51 R30.1
N$25
  Top 0.61: U$4.3 16.77,11.43 R32.2 23.76,11.8 24.77,10.79 24.77,3.17 24.13,2.54 HYD4.2
N$26
  Top 0.61: C20.2 7.99,9.89 8.26,10.16 U$4.7 11.43,10.16 12.06,10.79 R30.2
N$27
  Top 0.61: U$4.5 7.88,12.7 R29.1
N$28
  Top 0.61: U$4.6 7.25,11.43 C20.1 6.72,11.43 R28.1
N$29
  Top 0.61: R35.2 R36.1 16.77,40.91 15.24,39.37 IC1.3
N$30
  Top 0.406: U$5.4 49.25,62.51 48.9,62.87 35.56,62.87 34.92,62.23 34.92,43.18 34.29,42.55 22.23,42.55 20.95,41.27 R34.2
  Top 0.61: R34.2 19.95,40.33 IC1.1
N$31
  Top 0.61: R33.2 R34.1 18.15,40.38 17.78,40.01 17.14,40.01 16.51,39.37 IC1.2
N$32  (via drill 0.64 pad 0.61, 0.64 pad 0.81)
  Top 0.305: U$5.9 46,58.14 46.35,57.78 48.26,57.78 48.6,58.12 U$5.5
  Top 0.406: U$5.9 U$5.10 U$5.11 44.7,60.71 43.81,61.59 36.83,61.59 36.2,60.96 36.2,40.64 35.56,40.01 v21.59,40.01 | 13.97,41.27 R37.2 | R36.2 13.97,41.27 | 13.97,41.27 v13.97,40.01
  Bottom 0.406: v13.97,40.01 v21.59,40.01
N$33
  Top 0.61: IC1.5 12.7,39.74 R37.1 R39.2
N$34
  Top 0.61: R40.2 R38.1 9.79,40.38 10.16,40.01 10.79,40.01 11.43,39.37 IC1.6
N$35  (via drill 0.64 pad 0.61, 0.64 pad 0.81)
  Top 0.406: IC1.7 8.83,38.16 8.26,38.73 v5.71,38.73 | v22.86,41.27 34.92,41.27 35.56,41.91 35.56,61.59 36.2,62.23 46.35,62.23 46.65,61.94 U$5.8
  Top 0.61: R38.2 7.99,39 8.26,38.73 8.89,38.1 10.1,38.1 IC1.7
  Bottom 0.406: v5.71,38.73 5.71,40.64 6.35,41.27 v22.86,41.27
N$36
  Top 0.61: IC1.13 16.51,31.75 17.14,31.11 17.78,31.11 18.15,30.75 R48.1 R47.2
N$37  (via drill 0.64 pad 0.81, 0.64 pad 1.27)
  Top 0.305: U$6.8 59.98,63.16 60.33,63.5 v70.48,63.5
  Top 0.406: 20.3,30.48 v24.13,30.48
  Top 0.61: R48.2 19.95,30.79 | 19.95,30.79 IC1.14 | 19.95,30.79 19.99,30.79 20.3,30.48
  Bottom 0.305: 29.21,31.11 29.21,31.75 30.48,33.02 72.39,33.02 73.66,34.29 73.66,59.05 70.48,62.23 v70.48,63.5
  Bottom 0.406: v24.13,30.48 28.57,30.48 29.21,31.11
N$38
  Top 0.61: IC1.9 11.43,31.75 10.79,31.11 10.16,31.11 9.79,30.75 R43.1 R44.2
N$39  (via drill 0.64 pad 0.81, 0.64 pad 1.27)
  Top 0.305: U$6.4 62.59,60.68 62.87,60.96 v74.93,60.96
  Top 0.61: 8.26,30.11 8.26,31.75 9.46,32.96 IC1.8 | 8.26,30.11 R43.2 | 8.26,30.11 8.26,29.84 v6.35,29.84 | v20.95,24.13 v27.3,24.13
  Bottom 0.305: v27.3,24.13 30.48,24.13 31.11,24.77 31.11,31.11 31.75,31.75 73.66,31.75 74.93,33.02 v74.93,60.96
  Bottom 0.61: v6.35,29.84 6.35,24.77 6.99,24.13 v20.95,24.13
N$40
  Top 0.61: IC1.10 12.7,31.75 11.16,30.21 R42.1 R41.2
N$41
  Top 0.61: IC1.12 15.24,31.75 16.77,30.21 R45.1 R46.2
N$42  (via drill 0.64 pad 0.81, 0.64 pad 1.27)
  Top 0.305: v72.39,62.23 62.23,62.23 61.94,61.94 U$6.5 61.94,58.12 61.59,57.78 59.69,57.78 59.34,58.14 U$6.9 U$6.10 U$6.11
  Top 0.61: R42.2 13.97,29.84 | R45.2 13.97,29.84 | 13.97,29.84 v13.97,31.11 | v20.95,25.4 v27.3,25.4
  Bottom 0.305: v27.3,25.4 29.84,25.4 30.48,26.04 30.48,31.75 31.11,32.38 73.03,32.38 74.3,33.66 74.3,59.69 72.39,61.59 v72.39,62.23
  Bottom 0.61: v13.97,31.11 13.97,26.04 14.61,25.4 v20.95,25.4
N$43  (via drill 0.89)
  Top 0.61: R41.1 13.34,27.57 13.34,24.13 12.7,23.5 3.81,23.5 3.17,22.86 v3.17,21.59 R52.2
N$44  (via drill 0.89)
  Top 0.61: R46.1 14.97,24.39 17.78,21.59 v27.3,21.59 R51.2
N$45  (via drill 0.64 pad 0.61, 0.89)
  Top 0.406: R50.2 v51.44,21.59 51.44,22.86 50.8,23.5 30.48,23.5 29.84,24.13 v29.84,35.56 | R35.1 15.24,43.45 15.24,45.09 15.88,45.72 29.21,45.72 v29.84,45.09
  Bottom 0.406: v29.84,35.56 v29.84,45.09
N$46  (via drill 0.64 pad 0.61, 0.89)
  Top 0.406: R49.2 v75.56,21.59 75.56,22.86 74.3,24.13 31.75,24.13 31.11,24.77 v31.11,38.73 | R39.1 13.34,43.55 13.34,45.72 13.97,46.35 31.11,46.35 31.75,45.72 v31.11,44.45
  Bottom 0.406: v31.11,38.73 v31.11,44.45
N$47
  Top 0.406: U$9.28 63.5,27.3 64.14,27.94 64.14,33.66 61.59,36.2 U1.4
N$48
  Top 0.406: U$6.17 U$6.18 | U1.13 60.33,44.22 60.33,45.72 59.98,46.06 U$6.17 | U$5.17 U$5.18 47.3,55.55 47.62,55.88 59.69,55.88 59.98,55.59 U$6.17
N$49  (via drill 0.64 pad 0.61)
  Top 0.406: U1.11 61.59,45.09 61.94,45.42 U$6.20 61.94,53.63 60.96,54.61 60.96,56.52 60.33,57.15 v55.88,57.15 | v49.53,54.61 48.9,54.61 48.6,54.31 U$5.20
  Bottom 0.406: v55.88,57.15 50.16,57.15 49.53,56.52 v49.53,54.61
N$50  (via drill 0.64 pad 0.61)
  Top 0.406: U1.12 60.96,44.21 v60.96,47.62 61.28,47.95 U$6.19 | U$5.19 47.95,50.48 v48.26,50.16
  Bottom 0.406: v48.26,50.16 48.26,48.26 48.9,47.62 v60.96,47.62
N$52  (via drill 0.64 pad 1.27)
  Top 0.305: U2.10 48.91,46.37 49.53,46.99 53.98,46.99 55.24,48.26 v55.24,52.7 | U$6.23 63.88,53.73 v64.77,54.61
  Bottom 0.305: v55.24,52.7 55.24,53.98 55.88,54.61 v64.77,54.61
N$53
  Top 0.406: U2.13 46.96,48.23 47.62,48.9 49.53,48.9 49.9,49.27 U$5.22
N$54  (via drill 0.64 pad 1.27)
  Top 0.305: U2.11 48.26,46.99 48.9,47.62 53.34,47.62 53.98,48.26 v53.98,51.44 | U$6.22 63.23,54.88 v62.23,55.88
  Bottom 0.305: v53.98,51.44 53.98,55.24 54.61,55.88 v62.23,55.88
N$55
  Top 0.406: U$9.39 47.62,30.48 48.9,31.75 48.9,38.34 U2.5
N$56
  Top 0.406: U2.12 47.61,47.61 48.26,48.26 50.16,48.26 50.55,48.65 U$5.23
N$57
  Top 0.406: U$9.41 45.09,30.48 47.62,33.02 47.62,38.34 U2.3
N$58
  Top 0.406: U2.2 46.96,33.62 43.81,30.48 43.81,28.57 U$9.42
N$59
  Top 0.406: U$9.40 46.99,27.3 46.35,27.94 46.35,30.48 48.26,32.38 U2.4
N$60
  Top 0.406: U1.2 60.3,29.88 U$9.29
N$62
  Top 0.406: 16.38,64.27 16.38,64.51 R55.1
  Top 0.61: U$7.7 15.24,59.42 C30.1 14.97,61.33 15.88,62.23 C29.1 16.38,62.37 16.38,64.27 15.88,64.77
N$63
  Top 0.406: U1.3 60.95,35.58 62.87,33.66 U$9.27
N$64
  Top 0.406: C31.1 U$7.1
N$65  (via drill 0.64 pad 0.61)
  Top 0.406: C31.2 16.25,47.99 v16.51,48.26 | v12.7,57.15 13.89,57.15 U$7.8
  Top 0.813: D1.C 6.16,47.93 L1.1 13.9,47.93 C31.2
  Bottom 0.406: v16.51,48.26 16.51,55.88 15.24,57.15 v12.7,57.15
N$67  (via drill 0.64 pad 0.61)
  Top 0.406: v19.68,52.07 17.86,52.07 U$7.4
  Top 0.61: R54.2 v9.53,66.67 R53.1
  Bottom 0.406: v9.53,66.67 9.53,67.31 10.16,67.94 19.05,67.94 19.68,67.31 v19.68,52.07
N$69
  Top 0.61: U$7.9 16.51,55.24 U$7.6 16.51,59.42 C30.2 | 6.72,63.13 6.47,63.07 C32.C 5.45,63.13 R54.1
  Top 0.813: 6.47,63.07 5.71,62.31 D1.A 10.27,55.77 11.43,54.61 U$7.9 | R56.2 22.86,60.33 22.23,59.69 C30.2
VDD_3V3EXP
  Top 0.813: U$9.49 U$9.50
VDD_5V
  Top 0.813: U$9.51 U$9.52

### Text on the board
tPlace: o | o | o | o
tNames: Rumman Waqar (2015)